# Altium schematic sheet Interface.SchDoc
size A4
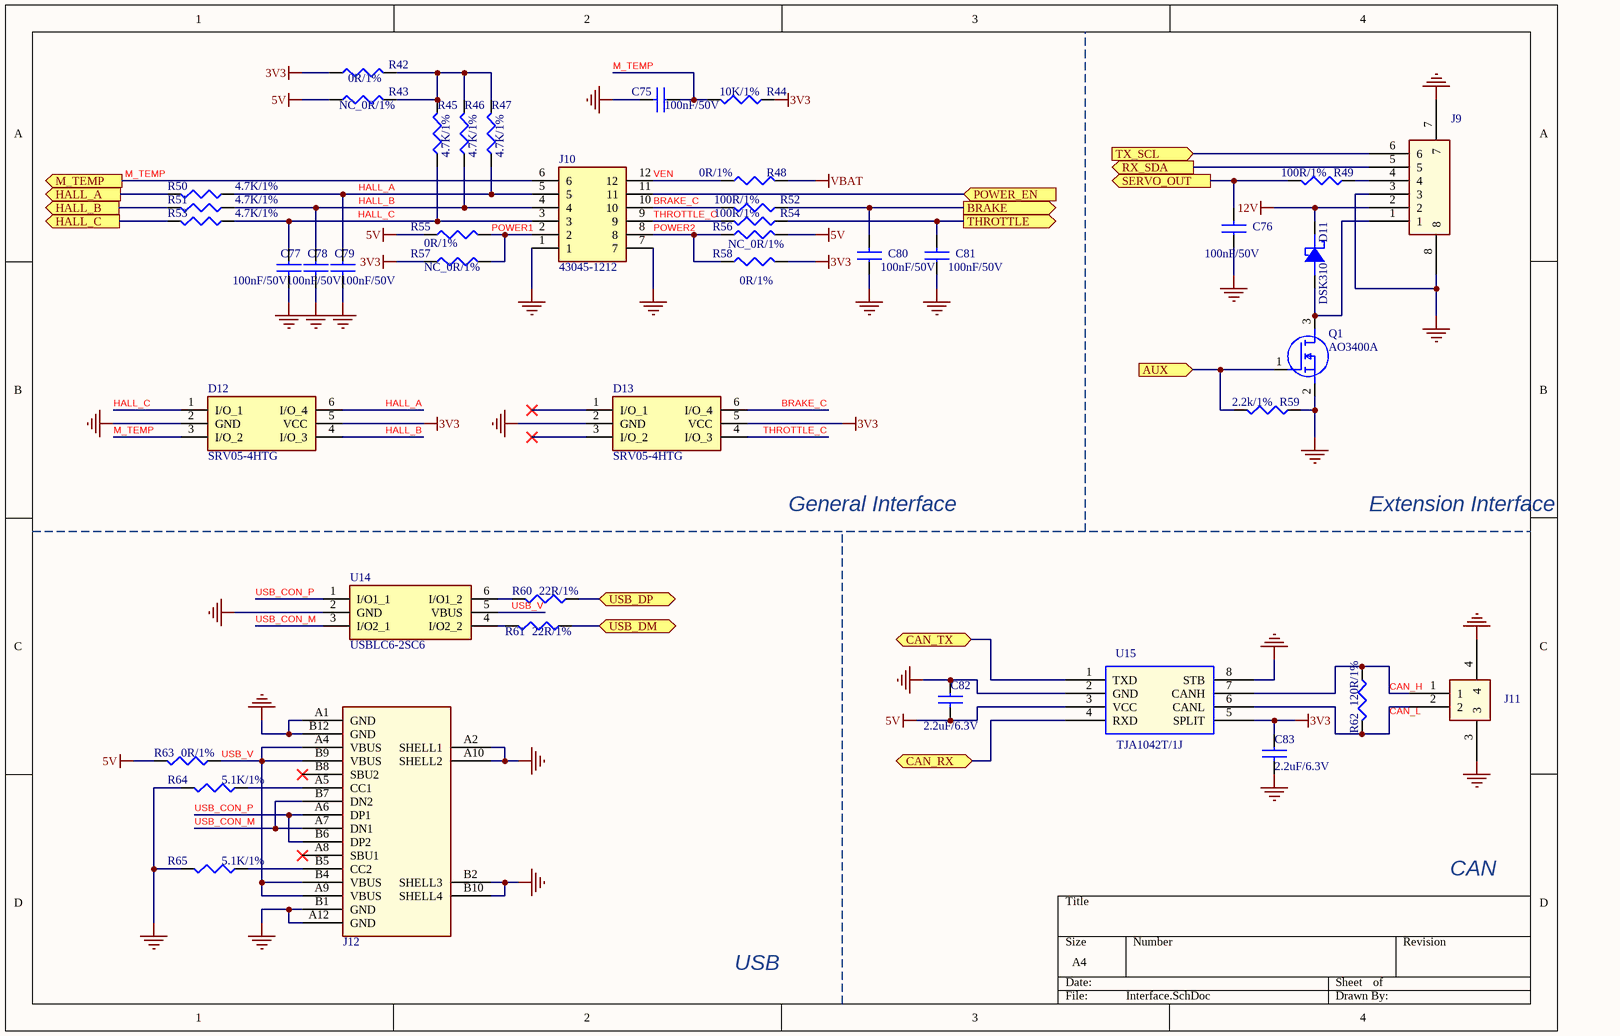
[diagram p0: Interface.SchDoc]

## Parts
C75  100nF/50V  [C0402]
C76  100nF/50V  [C0402]
C77  100nF/50V  [C0402]
C78  100nF/50V  [C0402]
C79  100nF/50V  [C0402]
C80  100nF/50V  [C0402]
C81  100nF/50V  [C0402]
C82  2.2uF/6.3V  [C0402]
C83  2.2uF/6.3V  [C0402]
D11  DSK310  [SOD-123F]
D12  SRV05-4HTG  [SOT95P280X145-6N]
D13  SRV05-4HTG  [SOT95P280X145-6N]
J9  1.25-6PWTDK  [BM06BGHSTBTLFSN]  (value not drawn)
J10  43045-1212  [43045-12YY_121314]
J11  1.25-2PWTDK  [BM02B-GHS-TBT_1]  (value not drawn)
J12  TYPE-C 16PLC-H10.0  [USB-C-SMD_SOUHAN_TYPE-C-16PLT-H6.5]  (value not drawn)
Q1  AO3400A  [SOT95P280X125-3N]
R42  0R/1%  [Solder Bridge_0402]
R43  NC_0R/1%  [Solder Bridge_0402]
R44  10K/1%  [R0402]
R45  4.7K/1%  [R0402]
R46  4.7K/1%  [R0402]
R47  4.7K/1%  [R0402]
R48  0R/1%  [R0402]
R49  100R/1%  [R0402]
R50  4.7K/1%  [R0402]
R51  4.7K/1%  [R0402]
R52  100R/1%  [R0402]
R53  4.7K/1%  [R0402]
R54  100R/1%  [R0402]
R55  0R/1%  [Solder Bridge_0402]
R56  NC_0R/1%  [Solder Bridge_0402]
R57  NC_0R/1%  [Solder Bridge_0402]
R58  0R/1%  [Solder Bridge_0402]
R59  2.2k/1%  [R0402]
R60  22R/1%  [R0402]
R61  22R/1%  [R0402]
R62  120R/1%  [R0402]
R63  0R/1%  [R0603]
R64  5.1K/1%  [R0402]
R65  5.1K/1%  [R0402]
U14  USBLC6-2SC6  [SOT95P280X145-6N]
U15  TJA1042T/1J  [SOP-8]

## Ports
AUX (in, see VESC_75100[2B], MCU[1C]), BRAKE (out, see VESC_75100[2B]), CAN_RX (bidir, see VESC_75100[2B]), CAN_TX (bidir, see VESC_75100[2B]), HALL_A (out, see VESC_75100[2A]), HALL_B (out, see VESC_75100[2A]), HALL_C (out, see VESC_75100[2B]), M_TEMP (out, see VESC_75100[2A]), POWER_EN (in, see VESC_75100[2B]), RX_SDA (out, see VESC_75100[2B]), SERVO_OUT (out, see VESC_75100[2B]), THROTTLE (out, see VESC_75100[2B]), TX_SCL (in, see VESC_75100[2B]), USB_DM (bidir, see VESC_75100[2B], MCU[1B]), USB_DP (bidir, see VESC_75100[2B], MCU[1B])

## Nets
3V3: C83.1 D12.5(VCC) D13.5(VCC) R42.2 R44.2 R57.1 R58.1 U15.5(SPLIT)
5V: C82.2 R43.2 R55.1 R56.1 R63.2 U15.3(VCC)
12V: D11.1(K) J9.2
GND: C75.2 C76.1 C77.2 C78.2 C79.2 C80.1 C81.1 C82.1 C83.2 D12.2(GND) D13.2(GND) J9.3 J9.7 J9.8 J10.1 J10.7 J11.3 J11.4 J12.A1(GND) J12.A2(SHELL1) J12.A10(SHELL2) J12.A12(GND) J12.B1(GND) J12.B2(SHELL3) J12.B10(SHELL4) J12.B12(GND) Q1.2(S) R59.2 R64.2 R65.2 U14.2(GND) U15.2(GND) U15.8(STB)
VBAT: R48.1
AUX: Q1.1(G) R59.1 ; port AUX
BRAKE: C80.2 R52.2 ; port BRAKE
BRAKE_C: D13.6(I/O_4) J10.10 R52.1
CAN_H: J11.1 R62.1 U15.7(CANH)
CAN_L: J11.2 R62.2 U15.6(CANL)
CAN_RX: U15.4(RXD) ; port CAN_RX
CAN_TX: U15.1(TXD) ; port CAN_TX
HALL_A: C79.1 D12.6(I/O_4) J10.5 R47.1 R50.1
HALL_A: R50.2 ; port HALL_A  [a separate net that carries the same name]
HALL_B: C78.1 D12.4(I/O_3) J10.4 R46.1 R51.1
HALL_B: R51.2 ; port HALL_B  [a separate net that carries the same name]
HALL_C: C77.1 D12.1(I/O_1) J10.3 R45.1 R53.1
HALL_C: R53.2 ; port HALL_C  [a separate net that carries the same name]
M_TEMP: C75.1 D12.3(I/O_2) J10.6 R44.1 ; port M_TEMP
POWER1: J10.2 R55.2 R57.2
POWER2: J10.8 R56.2 R58.2
POWER_EN: J10.11 ; port POWER_EN
RX_SDA: J9.5 ; port RX_SDA
SERVO_OUT: C76.2 R49.1 ; port SERVO_OUT
THROTTLE: C81.2 R54.2 ; port THROTTLE
THROTTLE_C: D13.4(I/O_3) J10.9 R54.1
TX_SCL: J9.6 ; port TX_SCL
USB_CON_M: J12.A7(DN1) J12.B7(DN2) U14.3(I/O2_1)
USB_CON_P: J12.A6(DP1) J12.B6(DP2) U14.1(I/O1_1)
USB_DM: R61.1 ; port USB_DM
USB_DP: R60.1 ; port USB_DP
USB_V: J12.A4(VBUS) J12.A9(VBUS) J12.B4(VBUS) J12.B9(VBUS) R63.1 U14.5(VBUS)
VEN: J10.12 R48.2
NetD11_2: D11.2(A) J9.1 Q1.3(D)
NetJ9_4: J9.4 R49.2
NetJ12_A5: J12.A5(CC1) R64.1
NetJ12_B5: J12.B5(CC2) R65.1
NetR42_1: R42.1 R43.1 R45.2 R46.2 R47.2
NetR60_2: R60.2 U14.6(I/O1_2)
NetR61_2: R61.2 U14.4(I/O2_2)

Not connected (* = marked no-connect by the designer): D13 1(I/O_1)* 3(I/O_2)*; J12 A8(SBU1)* B8(SBU2)*

## Notes on the sheet
- General Interface
- Extension Interface
- CAN
- USB

## Library data of the parts
C75-C83 = CAP NP: PCB Footprint: C0402
D11 = DIODE SCHOTTKY21: PCB Footprint: SOD-123F
D12 D13 = SRV05-4HTG: TVS Diode (Uni-directional); Manufacturer_Name: LITTELFUSE; Datasheet Link: https://componentsearchengine.com/Datasheets/2/SRV05-4HTG.pdf; Height: 1.45mm; Manufacturer_Part_Number: SRV05-4HTG; Mouser Part Number: 576-SRV05-4HTG; Mouser Price/Stock: https://www.mouser.co.uk/ProductDetail/Littelfuse/SRV05-4HTG?qs=TI15CVqcli3Liexbf3C%2FVA%3D%3D; Arrow Part Number: SRV05-4HTG; Arrow Price/Stock: https://www.arrow.com/en/products/srv05-4htg/littelfuse?region=nac
J10 = 43045-1212: Connector; Manufacturer_Name: Molex; Datasheet Link: https://www.molex.com/pdm_docs/sd/430450612_sd.pdf; Height: 9.91mm; Manufacturer_Part_Number: 43045-1212; Mouser Part Number: 538-43045-1212; Mouser Price/Stock: https://www.mouser.co.uk/ProductDetail/Molex/43045-1212?qs=359VwiUTsp27ERpkj8aHfQ%3D%3D
J12 = TYPE-C 16PLC-H6.5: 连接器类型:Type-C;标准:USB 3.1;公母:母;安装方式:直插;触点数量:16P;端口数量:1;额定电流 - 电源:5A;触头材质:-;触头镀层:-;工作温度范围:-40℃~+85℃;; Manufacturer: SHOU HAN(首韩); Add into BOM: yes; Gender: 母; Number of Contacts: 16P; Number of Ports: 1; Current Rating - Power (Max): 5A; Rated Voltage (Max): 20V; Connect-Disconnect Life: 1万次; Core Colour: 黑色; Symbol: TYPE-C 16PLC-H10.0; Device: TYPE-C 16PLC-H10.0; LCSC Part Name: Type-C 母 直插; Supplier Part: C3151747; Manufacturer Part: TYPE-C 16PLC-H10.0; Supplier Footprint: 插件; Datasheet: https://atta.szlcsc.com/upload/public/pdf/source/20240529/CC9428849977884A813B584EA396EFE9.pdf; Supplier: LCSC; Convert to PCB: yes; Connector Type: Type-C; Standard: USB 3.1; Mounting Style: 直插; Contact Material: -; Contact Plating: -; Operating Temperature Range: -40℃~+85℃
Q1 = AO3400A: MOSFET (N-Channel); Manufacturer_Name: Alpha & Omega Semiconductors; Datasheet Link: http://aosmd.com/res/data_sheets/AO3400A.pdf; Height: 1.25mm; Manufacturer_Part_Number: AO3400A; Arrow Part Number: AO3400A; Arrow Price/Stock: https://www.arrow.com/en/products/ao3400a/alpha-and-omega-semiconductor?utm_currency=USD&region=nac
R42 R43 R55-R58 = RESISTOR: PCB Footprint: R0402
R44-R54 R59-R65 = RESISTOR
  R44-R54 R59-R62 R64 R65: PCB Footprint: R0402
  R63: PCB Footprint: R0603
U14 = USBLC6-2SC6: Integrated Circuit; Manufacturer_Name: STMicroelectronics; Datasheet Link: http://www.st.com/st-web-ui/static/active/en/resource/technical/document/datasheet/CD00050750.pdf; Height: 1.45mm; Manufacturer_Part_Number: USBLC6-2SC6; Mouser Part Number: 511-USBLC6-2SC6; Mouser Price/Stock: https://www.mouser.co.uk/ProductDetail/STMicroelectronics/USBLC6-2SC6?qs=po45yt2pPpu%2FhNIlwQdTlg%3D%3D; Arrow Part Number: USBLC6-2SC6; Arrow Price/Stock: https://www.arrow.com/en/products/usblc6-2sc6/stmicroelectronics?utm_currency=USD&region=europe
U15 = TJA1042T/1J: PCB Footprint: SOP-8